# EAGLE design DuAnSacXeDien_V1.0 (EAGLE 9.6.1)
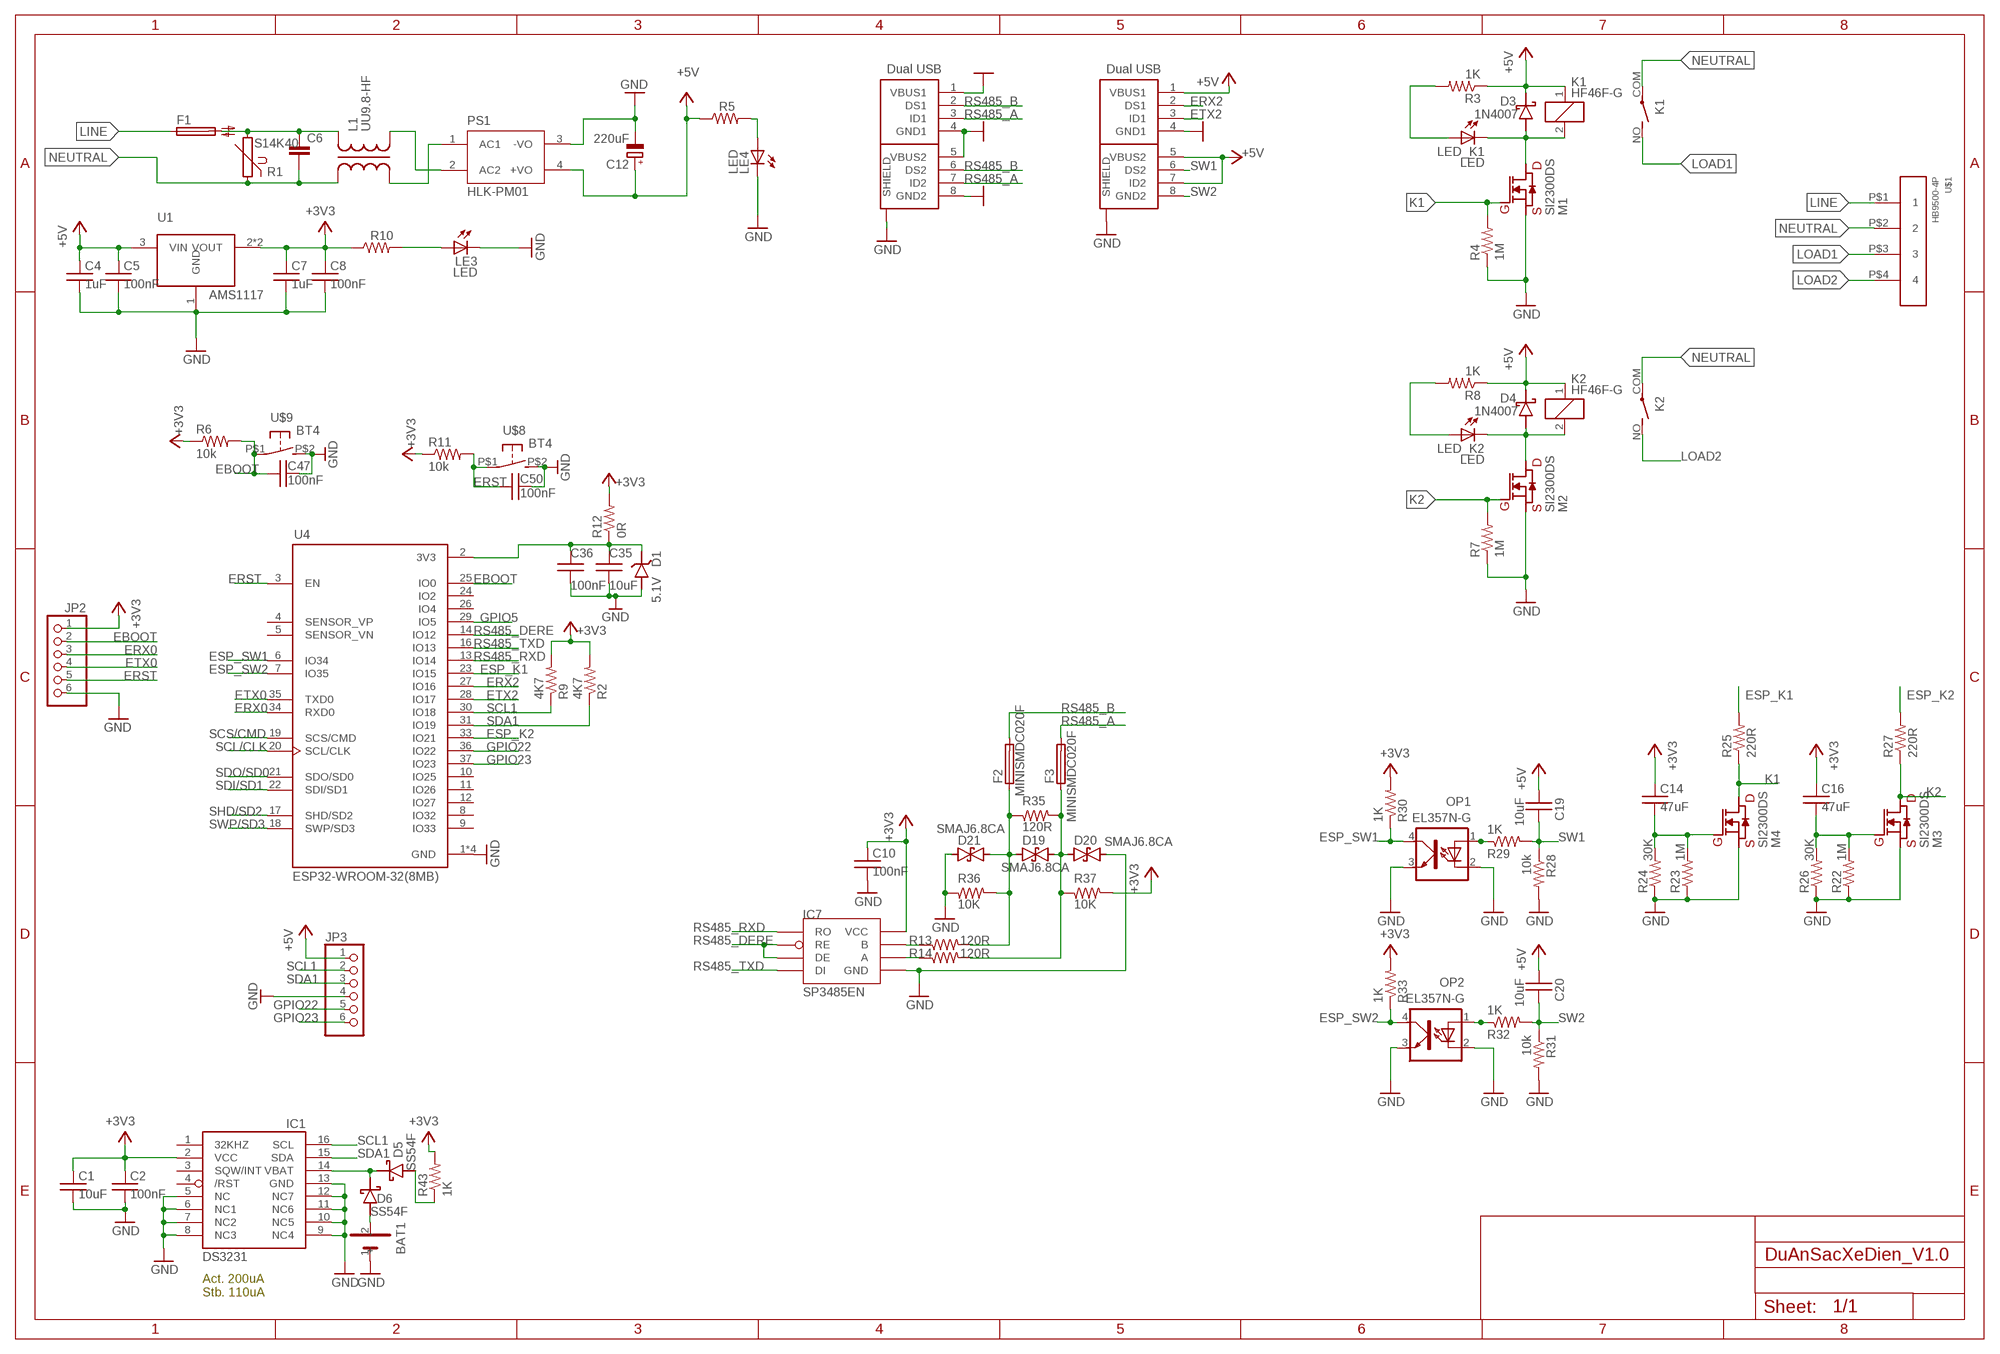
[diagram p0: schematic, sheet 1]

## Parts
BAT1  CR1220  CR1220CR1220-SMD  [CR1220]
C1  10uF  C0603  [0603]
C2  100nF  C0603  [0603]
C4  1uF  C0603  [0603]
C5  100nF  C0603  [0603]
C6  C-EU150-064X183  [C150-064X183]
C7  1uF  C0603  [0603]
C8  100nF  C0603  [0603]
C10  100nF  C0603  [0603]
C12  220uF  CPOL-EU153CLV-0605  [153CLV-0605]
C14  47uF  C0805  [0805]
C16  47uF  C0805  [0805]
C19  10uF  C0603  [0603]
C20  10uF  C0603  [0603]
C35  10uF  C0603  [0603]
C36  100nF  C0603  [0603]
C47  100nF  C0603  [0603]
C50  100nF  C0603  [0603]
D1  5.1V  BZT52CXXX  [SOD123]
D3  1N4007  SS54F  [SMAF]
D4  1N4007  SS54F  [SMAF]
D5  SS54F  [SMAF]
D6  SS54F  [SMAF]
D19  SMAJ6.8CA  SMAJ-CA  [DO-214AC-BI]
D20  SMAJ6.8CA  SMAJ-CA  [DO-214AC-BI]
D21  SMAJ6.8CA  SMAJ-CA  [DO-214AC-BI]
F1  TE5  [TE5]
F2  MINISMDC020F  MINISMDC  [C1812]
F3  MINISMDC020F  MINISMDC  [C1812]
IC1  DS3231/SO  [SO16W]
IC7  SP3485EN  [SOIC-8]
JP2  PINHD-1X6  [1X06]
JP3  PINHD-1X6/LONG  [1X06]
K1  HF46F-G  LD14H  [LD]
K2  HF46F-G  LD14H  [LD]
L1  UU9.8-HF  [UU9.8-HF]
LE3  LED  [LED3MM]
LE4  LED  [LED3MM]
LED_K1  LED  [LED3MM]
LED_K2  LED  [LED3MM]
M1  SI2300DS  MOSFETN  [SOT23(1)]
M2  SI2300DS  MOSFETN  [SOT23(1)]
M3  SI2300DS  MOSFETN  [SOT23(1)]
M4  SI2300DS  MOSFETN  [SOT23(1)]
OP1  EL357N-G  [SOP4]
OP2  EL357N-G  [SOP4]
PS1  HLK-PM01  [HLK-PMXX]
R1  S14K40  [S14K40]
R2  4K7  R0603  [0603]
R3  1K  R0603  [0603]
R4  1M  R0603  [0603]
R5  1K  R0603  [0603]
R6  10k  R0603  [0603]
R7  1M  R0603  [0603]
R8  1K  R0603  [0603]
R9  4K7  R0603  [0603]
R10  1K  R0603  [0603]
R11  10k  R0603  [0603]
R12  0R  R0603  [0603]
R13  120R  R0603  [0603]
R14  120R  R0603  [0603]
R22  1M  R0603  [0603]
R23  1M  R0603  [0603]
R24  30K  R0603  [0603]
R25  220R  R0603  [0603]
R26  30K  R0603  [0603]
R27  220R  R0603  [0603]
R28  10k  R0603  [0603]
R29  1K  R0603  [0603]
R30  1K  R0603  [0603]
R31  10k  R0603  [0603]
R32  1K  R0603  [0603]
R33  1K  R0603  [0603]
R35  120R  R0603  [0603]
R36  10K  R0603  [0603]
R37  10K  R0603  [0603]
R43  1K  R0603  [0603]
U1  LD1117  AMS1117  [SOT223-3.3]
U4  ESP32-WROOM-32(8MB)  [MODULE_ESP32-WROOM-32(8MB)]
U$1  HB9500-4P  [HB9500-4P]
U$2  DUAL_USB  [DUAL_USB]
U$7  DUAL_USB  [DUAL_USB]
U$8  BT4  [BT4]
U$9  BT4  [BT4]

## Nets
+3V3: C1.1 C2.1 C7.1 C8.1 C10.1 C14.1 C16.1 IC1.2(VCC) IC7.8(VCC) JP2.1 R2.2 R6.1 R9.2 R10.1 R11.1 R12.2 R30.2 R33.2 R37.2 R43.2 U1.2(VOUT) U1.4(VOUT)
+5V: C4.1 C5.1 C12.+ C19.1 C20.1 D3.C D4.C JP3.1 K1.1 K2.1 PS1.4(+VO) R3.1 R5.1 R8.1 U1.3(VIN) U$2.1(VBUS1) U$2.5(VBUS2) U$2.7(ID2)
EBOOT: C47.1 JP2.2 R6.2 U4.25(IO0) U$9.P$1
ERST: C50.1 JP2.5 R11.2 U4.3(EN) U$8.P$1
ERX0: JP2.3 U4.34(RXD0)
ERX2: U4.27(IO16) U$2.2(DS1)
ESP_K1: R25.2 U4.23(IO15)
ESP_K2: R27.2 U4.33(IO21)
ESP_SW1: OP1.4(COL) R30.1 U4.6(IO34)
ESP_SW2: OP2.4(COL) R33.1 U4.7(IO35)
ETX0: JP2.4 U4.35(TXD0)
ETX2: U4.28(IO17) U$2.3(ID1)
GND: BAT1.1(-) C1.2 C2.2 C4.2 C5.2 C7.2 C8.2 C10.2 C12.- C35.2 C36.2 C47.2 C50.2 D1.A D20.2 D21.1 IC1.5(NC) IC1.6(NC1) IC1.7(NC2) IC1.8(NC3) IC1.9(NC4) IC1.10(NC5) IC1.11(NC6) IC1.12(NC7) IC1.13(GND) IC7.5(GND) JP2.6 JP3.4 LE3.K(C) LE4.K(C) M1.2(S) M2.2(S) M3.2(S) M4.2(S) OP1.2(C) OP1.3(EMIT) OP2.2(C) OP2.3(EMIT) PS1.3(-VO) R4.1 R7.1 R22.1 R23.1 R24.1 R26.1 R28.2 R31.2 R36.1 U1.1(GND) U4.1(GND) U4.15(GND) U4.38(GND) U4.39(GND) U$2.4(GND1) U$2.TAB1(SHIELD) U$2.TAB2(SHIELD) U$2.TAB3(SHIELD) U$2.TAB4(SHIELD) U$7.1(VBUS1) U$7.4(GND1) U$7.5(VBUS2) U$7.8(GND2) U$7.TAB1(SHIELD) U$7.TAB2(SHIELD) U$7.TAB3(SHIELD) U$7.TAB4(SHIELD) U$8.P$2 U$9.P$2
GPIO5: U4.29(IO5)
GPIO22: JP3.5 U4.36(IO22)
GPIO23: JP3.6 U4.37(IO23)
K1: M1.1(G) M4.3(D) R4.2 R25.1
K2: M2.1(G) M3.3(D) R7.2 R27.1
LINE: F1.1 U$1.P$1
LOAD1: K1.NO(2:S) U$1.P$3
LOAD2: K2.NO(2:S) U$1.P$4
N$1: D3.A K1.2 LED_K1.K(C) M1.3(D)
N$2: D19.1 D21.2 F2.1 R13.2 R35.1 R36.2
N$3: D4.A K2.2 LED_K2.K(C) M2.3(D)
N$4: LED_K2.A R8.2
N$5: OP1.1(A) R29.1
N$6: LED_K1.A R3.2
N$7: D19.2 D20.1 F3.1 R14.2 R35.2 R37.1
N$8: OP2.1(A) R32.1
N$9: C16.2 M3.1(G) R22.2 R26.2
N$10: C6.1 F1.2 L1.4 R1.2
N$11: IC7.6(A) R14.1
N$12: IC7.7(B) R13.1
N$13: LE4.A R5.2
N$16: C35.1 C36.1 D1.C R12.1 U4.2(3V3)
N$17: BAT1.2(+) D6.A
N$18: L1.3 PS1.2(AC2)
N$19: L1.2 PS1.1(AC1)
N$25: D5.A R43.1
N$26: C14.2 M4.1(G) R23.2 R24.2
N$36: LE3.A R10.2
NEUTRAL: C6.2 K1.COM(2:P) K2.COM(2:P) L1.1 R1.1 U$1.P$2
RS485_A: F3.2 U$7.3(ID1) U$7.7(ID2)
RS485_B: F2.2 U$7.2(DS1) U$7.6(DS2)
RS485_DERE: IC7.2(RE) IC7.3(DE) U4.14(IO12)
RS485_RXD: IC7.1(RO) U4.13(IO14)
RS485_TXD: IC7.4(DI) U4.16(IO13)
SCL1: IC1.16(SCL) JP3.2 R9.1 U4.30(IO18)
SCL/CLK: U4.20(SCL/CLK)
SCS/CMD: U4.19(SCS/CMD)
SDA1: IC1.15(SDA) JP3.3 R2.1 U4.31(IO19)
SDI/SD1: U4.22(SDI/SD1)
SDO/SD0: U4.21(SDO/SD0)
SHD/SD2: U4.17(SHD/SD2)
SW1: C19.2 R28.1 R29.2 U$2.6(DS2)
SW2: C20.2 R31.1 R32.2 U$2.8(GND2)
SWP/SD3: U4.18(SWP/SD3)
VBAT: D5.C D6.C IC1.14(VBAT)
Unconnected: IC1.1(32KHZ) IC1.3(SQW/INT) IC1.4(/RST) U4.4(SENSOR_VP) U4.5(SENSOR_VN) U4.8(IO32) U4.9(IO33) U4.10(IO25) U4.11(IO26) U4.12(IO27) U4.24(IO2) U4.26(IO4)

## Notes on the sheet
- Act. 200uA
  Stb. 110uA

## Library data of the parts
BAT1 = An:CR1220
C1 C2 C4 C5 C7 C8 C10 C19 C20 = Dkoi-updated:C0603
C6 = rcl:C-EU: CAPACITOR, European symbol; SPICEPREFIX: C
C12 = rcl:CPOL-EU: POLARIZED CAPACITOR, European symbol; SPICEPREFIX: C
C14 C16 = Bao:C0805
C35 C36 C47 C50 = Dkoi:C0603
D1 = Dkoi:BZT52CXXX
D3-D6 = Uy_SMD:SS54F
D19-D21 = TADT:SMAJ-CA: Bi-directional TVS diode Datasheet <https://www.littelfuse.com/~/media/electronics/datasheets/tvs_diodes/littelfuse_tvs_diode_smaj_datasheet.pdf.pdf>
F1 = fuse:TE5: FUSE Wickmann; OC_FARNELL: unknown; OC_NEWARK: unknown
F2 F3 = TADT:MINISMDC: Polyswitch Resetable Fuse Datasheet <https://www.littelfuse.com/~/media/electronics/datasheets/resettable_ptcs/littelfuse_ptc_minismd_catalog_datasheet.pdf.pdf> Mounting Type: Surface Mount Package Case: 1812 (4532 Metric), Concave Size Dimension: 0.179" L x 0.128" W (4.55mm x 3.24mm) Thickness (Max): 0.035" (0.89mm)
IC1 = TADT:DS3231
IC7 = Uy_SMD:SP3485EN
JP2 = pinhead:PINHD-1X6: PIN HEADER
JP3 = pinhead_v2:PINHD-1X6: PIN HEADER
K1 K2 = relay:LD?*: Slim Power Relay NAiS Source: http://www.mew-europe.com/.. en_ds_61112_0000.pdf; OC_FARNELL: unknown; OC_NEWARK: unknown
L1 = Dkoi-updated:UU9.8-HF
LE3 LE4 LED_K1 LED_K2 = Uy_SMD:LED
M1-M4 = Dkoi:MOSFETN
OP1 OP2 = Dkoi-updated:EL357N-G
PS1 = HLK:HLK-PM: AC DC 220V to 3V-5V-12V-24V 3W Isolated Switching Step-Down Power Supply Module Converter Variant Output Datasheet thegioiic.com HLK-PM03 3.3V http://www.hlktech.net/product_detail.php?ProId=59 https://www.thegioiic.com/products/hlk-pm03-chuyen-doi-ac-dc-220-3-3v-3w-hi-link HLK-PM01 5.0V http://www.hlktech.net/product_detail.php?ProId=54 https://www.thegioiic.com/products/hlk-5m05-chuyen-doi-ac-dc-220-5v-5w-hi-link HLK-PM12 12.0V http://www.hlktech.net/product_detail.php?ProId=56 https://www.thegioiic.com/products/hlk-pm12-chuyen-doi-ac-dc-220-12v-3w-hi-link HLK-PM24 24.0V http://www.hlktech.net/product_detail.php?ProId=81 https://www.thegioiic.com/products/hlk-pm24-chuyen-doi-ac-dc-220-24v-3w-hi-link; DATASHEET: http://www.hlktech.net/product_detail.php?ProId=54; THEGIOIIC: https://www.thegioiic.com/products/hlk-5m05-chuyen-doi-ac-dc-220-5v-5w-hi-link
R1 = varistor:S14K40: VARISTOR
R2-R5 R7-R10 R13 R14 R22-R33 R35-R37 R43 = Dkoi-updated:R0603
R6 R11 R12 = Dkoi:R0603
U1 = An:AMS1117
U4 = Uy_SMD:ESP32-WROOM-32(8MB): WIFI MODULE 64 MBITS SPI FLASH Check prices <https://pricing.snapeda.com/parts/ESP32-WROOM-32%20%288MB%29/Espressif%20Systems/view-part?ref=eda>; AVAILABILITY: Not in stock; DESCRIPTION: Bluetooth, WiFi 802.11b/g/n, Bluetooth v4.2 +EDR, Class 1, 2 and 3 Transceiver Module 2.4GHz ~ 2.5GHz - Surface Mount; MF: Espressif Systems; MP: ESP32-WROOM-32 (8MB); PACKAGE: Module Espressif Systems; PRICE: None
U$1 = Uy_DIP:HB9500-4P
U$2 U$7 = Bao:DUAL_USB
U$8 U$9 = Uy_SMD:BT4

## Board
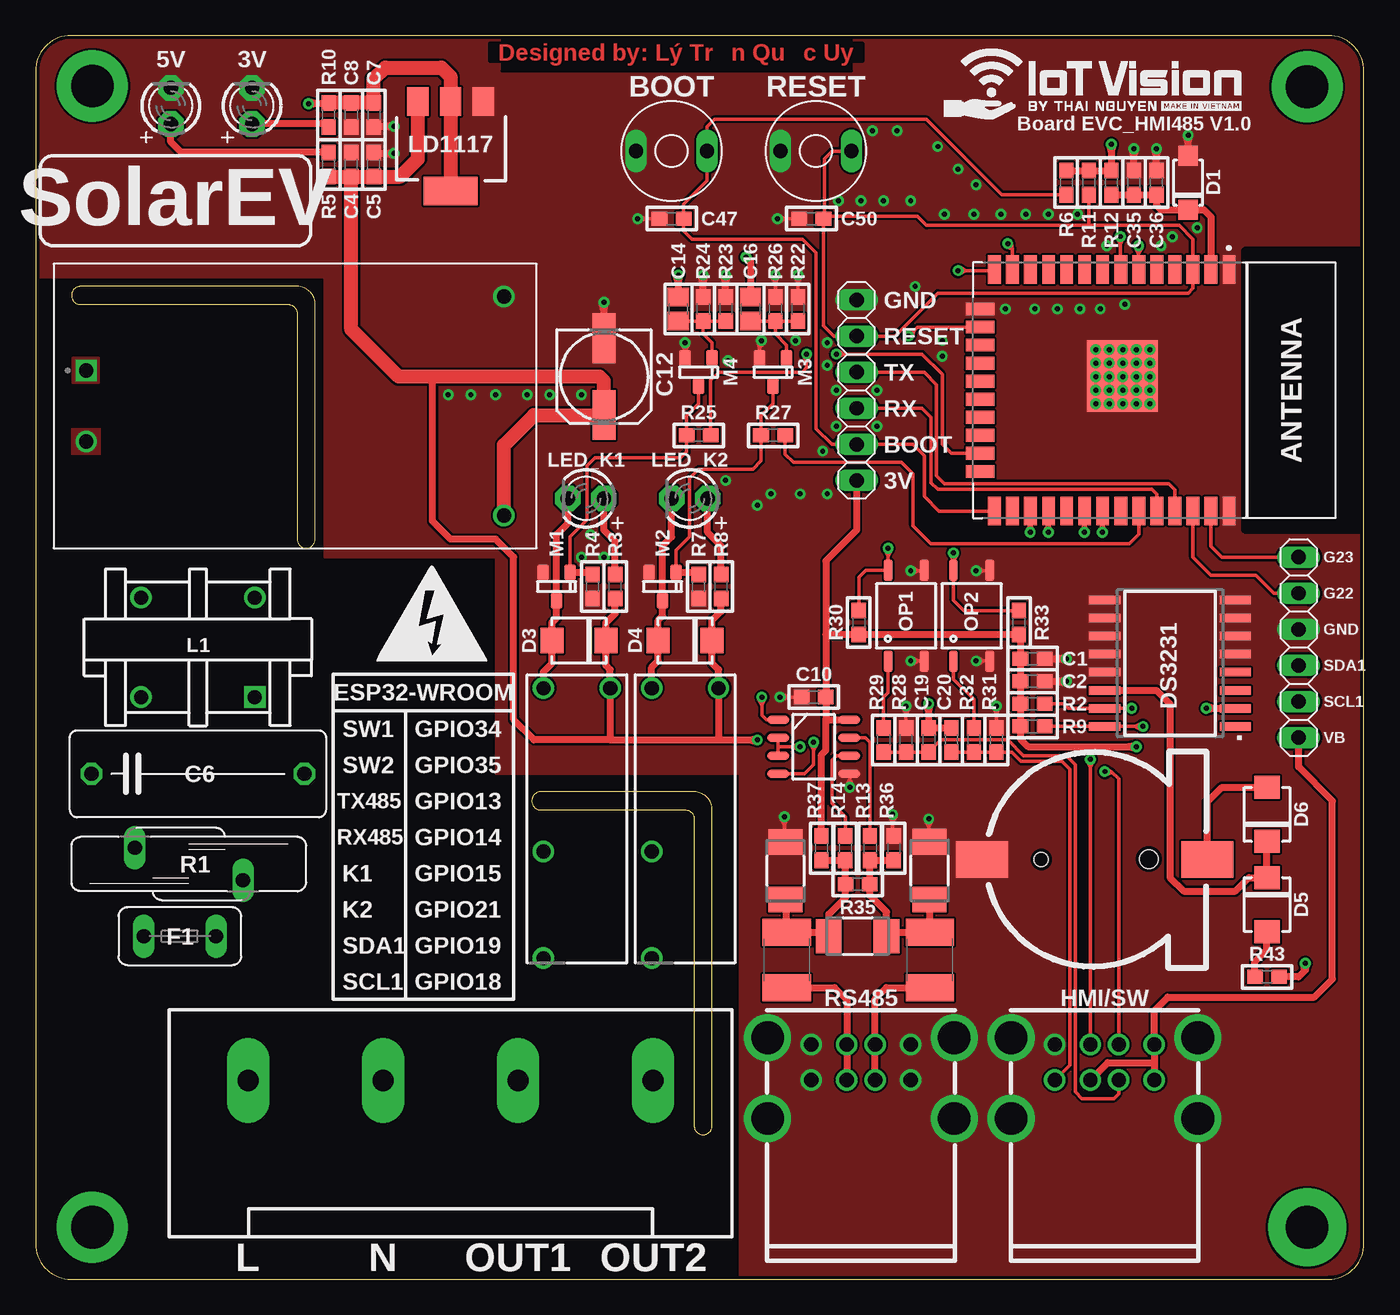
[diagram p1: board, top side]
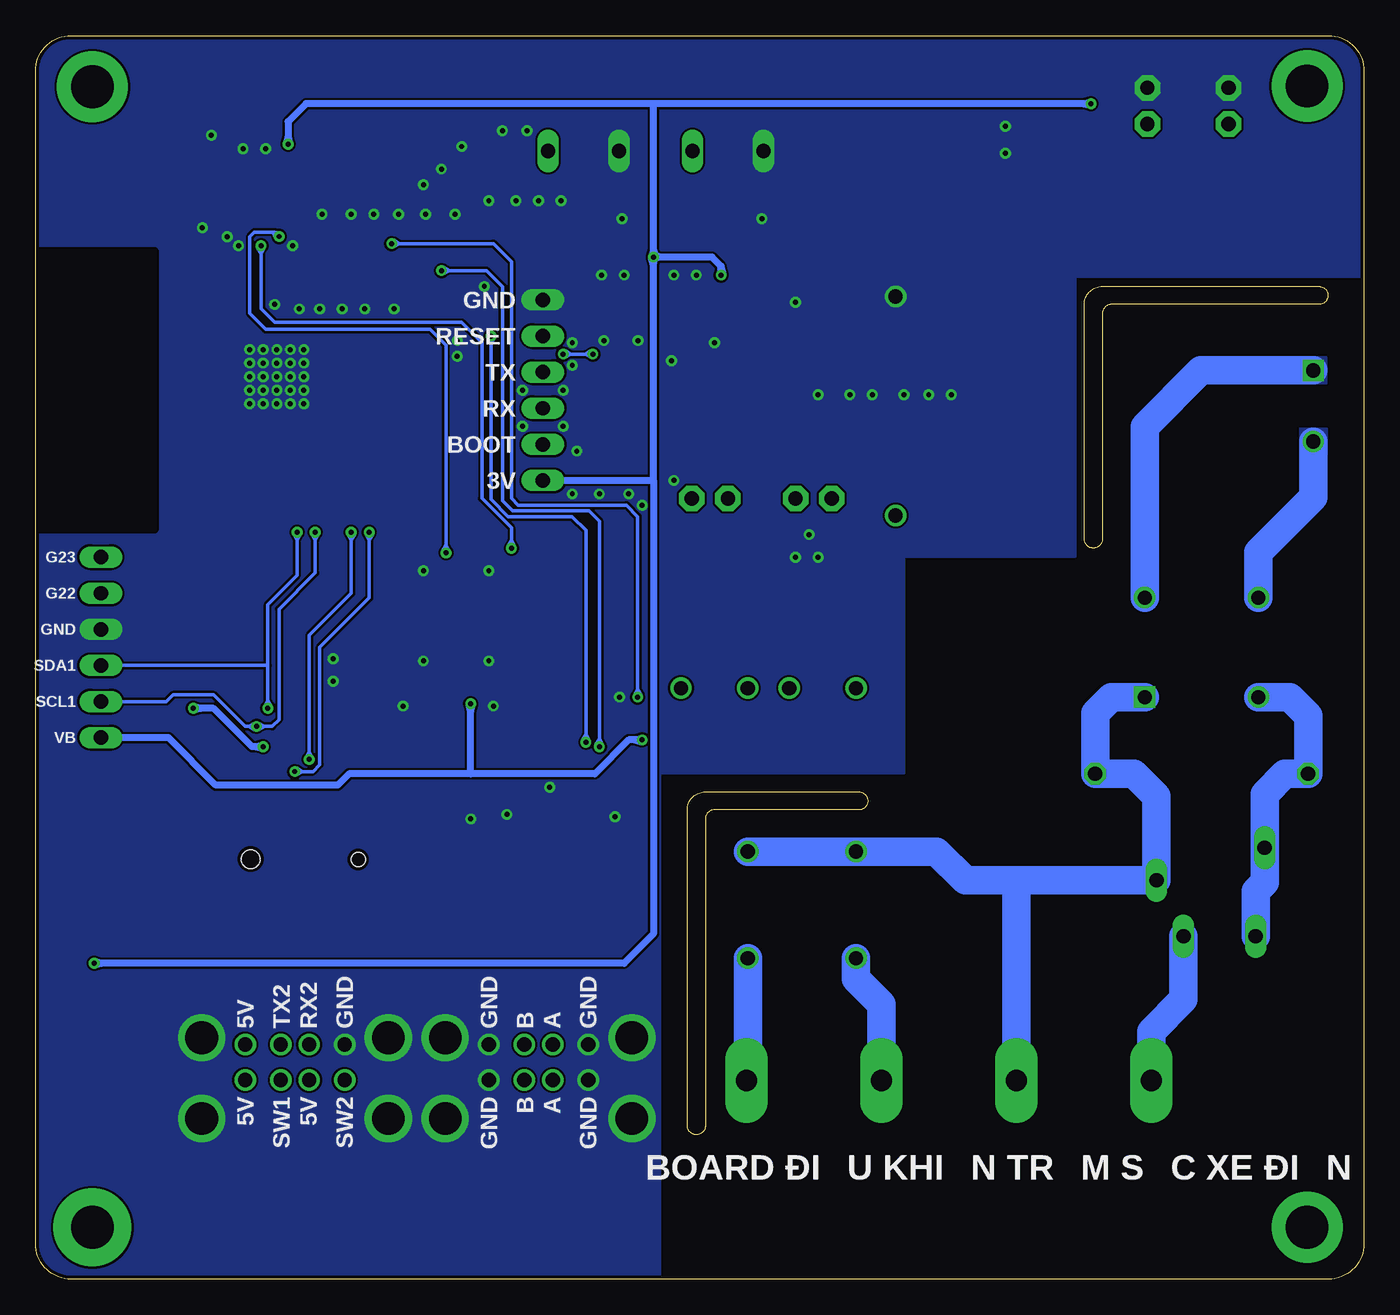
[diagram p2: board, bottom side, seen from below]

Size 93.5 x 87.5 mm. Coordinates in mm from the lower left corner, seen from the top.
Outline: 35.56,34.29 arc90 34.92,33.66 arc90 35.56,33.02 45.72,33.02 arc-90 46.35,32.38 46.35,10.79 arc90 46.99,10.16 arc90 47.62,10.79 47.62,33.02 arc90 46.35,34.29 35.56,34.29
Outline: 3.17,69.85 arc90 2.54,69.22 arc90 3.17,68.58 17.78,68.58 arc-90 18.41,67.94 18.41,52.07 arc90 19.05,51.44 arc90 19.68,52.07 19.68,68.58 arc90 18.41,69.85 3.17,69.85
Outline: 0,2.5 arc90 2.5,0 91,0 arc90 93.5,2.5 93.5,85 arc90 91,87.5 2.5,87.5 arc90 0,85 0,2.5
Copper layers (1*16): Top 0.035mm / dielectric 1.6mm / Bottom 0.035mm
Design rules "Dkoi": minimum track width 0.15mm, minimum drill 0.3mm, track to track 0.15mm, track to pad 0.15mm, pad to pad 0.15mm, via to via 0.15mm, smd to smd 0mil, copper to edge 0.25mm, drill to drill 0.15mm, minimum pad ring 10mil, minimum via ring 8mil, stop-mask expansion 4mil, vias tented up to drill 0.5mm, thermal gap 10mil

### Footprints (pad centres in the part's own frame; a part is rotated, then mirrored left to right if it is on the bottom)
CR1220 = smd 3.658 x 2.54: 1 -7.671,0; 2 8.179,0 | hole 1: -3.505,0 | hole 1.3: 4.064,0.025
0603 = smd 1.1 x 1: 1 -0.85,0; 2 0.85,0
C150-064X183 = drill 1.016 octagon: 1 -7.493,0; 2 7.493,0
153CLV-0605 = smd 3.5 x 1.6: + 2.7,0; - -2.7,0
0805 = smd 1.3 x 1.5: 1 -0.85,0; 2 0.85,0
SOD123 = smd 1.4 x 1.4: A 0,-1.9; C 0,1.9
SMAF = smd 1.6 x 1.8: A 0,0; C 3.8,0
DO-214AC-BI = smd 1.8 x 2.4: 1 -2.025,0; 2 2.025,0
TE5 = drill 1.016 long: 1 -2.54,0; 2 2.54,0
C1812 = smd 1.9 x 3.4: 1 -1.95,0; 2 1.95,0
SO16W = smd 0.6 x 2.2: 1 -4.445,-4.6; 2 -3.175,-4.6; 3 -1.905,-4.6; 4 -0.635,-4.6; 5 0.635,-4.6; 6 1.905,-4.6; 7 3.175,-4.6; 8 4.445,-4.6; 9 4.445,4.6; 10 3.175,4.6; 11 1.905,4.6; 12 0.635,4.6; 13 -0.635,4.6; 14 -1.905,4.6; 15 -3.175,4.6; 16 -4.445,4.6
SOIC-8 = smd 0.6 x 1.55: 1 -1.905,-2.5; 2 -0.635,-2.5; 3 0.635,-2.5; 4 1.905,-2.5; 5 1.905,2.5; 6 0.635,2.5; 7 -0.635,2.5; 8 -1.905,2.5
1X06 = drill 1.016 long: 1 -6.35,0; 2 -3.81,0; 3 -1.27,0; 4 1.27,0; 5 3.81,0; 6 6.35,0
LD = drill 1: 1 -9.2,2.35; 2 -9.2,-2.35; COM 2.3,-2.35; NO 9.8,-2.35
UU9.8-HF = drill 1 square: 1 -4,3.5 | drill 1: 2 -4,-3.5; 3 4,-3.5; 4 4,3.5
LED3MM = drill 1 pad 1.8 octagon: A -1.27,0; K 1.27,0
SOT23(1) = smd 0.8 x 1.1: 1 -0.95,-1; 2 0.95,-1; 3 0,1
SOP4 = smd 1.5 x 0.6: 1 -3.2,1.27; 2 -3.2,-1.27; 3 3.2,-1.27; 4 3.2,1.27
HLK-PMXX = drill 1 square: 1 -15.48,2.34 | drill 1: 2 -15.48,-2.66; 3 13.92,7.54; 4 13.92,-7.86
S14K40 = drill 1.016 long: 1 -1.143,-3.81; 2 1.143,3.81
SOT223-3.3 = smd 1.5 x 2: 1 -2.3,-2.54; 2 0,-2.54; 3 2.3,-2.54 | smd 3.8 x 2: 4 0,3.76
MODULE_ESP32-WROOM-32(8MB) = smd 2 x 0.9: 1 -8.5,5.26; 2 -8.5,3.99; 3 -8.5,2.72; 4 -8.5,1.45; 5 -8.5,0.18; 6 -8.5,-1.09; 7 -8.5,-2.36; 8 -8.5,-3.63; 9 -8.5,-4.9; 10 -8.5,-6.17; 11 -8.5,-7.44; 12 -8.5,-8.71; 13 -8.5,-9.98; 14 -8.5,-11.25; 25 8.5,-11.25; 26 8.5,-9.98; 27 8.5,-8.71; 28 8.5,-7.44; 29 8.5,-6.17; 30 8.5,-4.9; 31 8.5,-3.63; 32 8.5,-2.36; 33 8.5,-1.09; 34 8.5,0.18; 35 8.5,1.45; 36 8.5,2.72; 37 8.5,3.99; 38 8.5,5.26 | smd 0.9 x 2: 15 -5.715,-12.25; 16 -4.445,-12.25; 17 -3.175,-12.25; 18 -1.905,-12.25; 19 -0.635,-12.25; 20 0.635,-12.25; 21 1.905,-12.25; 22 3.175,-12.25; 23 4.445,-12.25; 24 5.715,-12.25 | smd 5 x 5: 39 -1,-2.24
HB9500-4P = drill 1.5 pad 3 long: P$1 -14.25,0; P$2 -4.75,0; P$3 4.75,0; P$4 14.25,0
DUAL_USB = drill 1 pad 1.5: 1 0,0; 2 2.5,0; 3 4.5,0; 4 7,0; 5 0,2.5; 6 2.5,2.5; 7 4.5,2.5; 8 7,2.5 | drill 2.3 pad 2.8: TAB1 -3.07,-0.48; TAB2 10.07,-0.48; TAB3 -3.07,5.2; TAB4 10.07,5.2
BT4 = drill 1 long: P$1 -2.5,0; P$2 2.5,0

### Placement (x,y rotation side)
BAT1  74.3,29.53 0 top
C1  70.17,43.66 0 top
C2  70.17,42.07 0 top
C4  22.23,78.42 90 top
C5  23.81,78.42 90 top
C6  11.43,35.56 0 top
C7  23.81,81.92 270 top
C8  22.23,81.92 270 top
C10  54.77,40.96 180 top
C12  40.01,63.5 270 top
C14  45.24,68.26 270 top
C16  50.32,68.26 270 top
C19  62.87,37.94 270 top
C20  64.45,37.94 270 top
C35  77.31,77.15 90 top
C36  78.9,77.15 90 top
C47  44.77,74.61 180 top
C50  54.61,74.61 180 top
D1  81.12,77.15 180 top
D3  36.35,44.93 0 top
D4  43.81,44.93 0 top
D5  86.68,24.45 90 top
D6  86.68,34.61 270 top
D19  57.86,24.13 180 top
D20  52.78,28.73 90 top
D21  62.92,28.75 270 top
F1  10.16,24.13 180 top
F2  62.94,22.46 270 top
F3  52.86,22.46 270 top
IC1  79.85,43.34 90 top
IC7  54.77,37.47 270 top
JP2  57.78,62.55 90 top
JP3  88.9,44.45 90 top
K1  38.1,32.38 270 top
K2  45.72,32.38 270 top
L1  11.43,44.45 180 top
LE3  15.24,82.55 90 top
LE4  9.53,82.55 90 top
LED_K1  38.73,54.93 180 top
LED_K2  46.04,54.93 180 top
M1  36.67,48.74 180 top
M2  44.13,48.74 180 top
M3  51.91,63.82 180 top
M4  46.67,63.82 180 top
OP1  61.28,46.67 90 top
OP2  65.88,46.67 90 top
PS1  19.05,61.59 0 top
R1  10.79,29.21 90 top
R2  70.17,40.48 180 top
R3  40.8,48.74 90 top
R4  39.21,48.74 90 top
R5  20.64,78.42 90 top
R6  72.55,77.15 270 top
R7  46.67,48.74 90 top
R8  48.26,48.74 90 top
R9  70.17,38.89 180 top
R10  20.64,81.92 270 top
R11  74.14,77.15 270 top
R12  75.72,77.15 90 top
R13  58.74,30.32 270 top
R14  56.99,30.32 270 top
R22  53.66,68.26 270 top
R23  48.58,68.26 270 top
R24  46.99,68.26 270 top
R25  46.67,59.37 0 top
R26  52.07,68.26 270 top
R27  51.91,59.37 0 top
R28  61.28,37.94 90 top
R29  59.69,37.94 270 top
R30  57.94,46.2 270 top
R31  67.63,37.94 90 top
R32  66.04,37.94 270 top
R33  69.22,46.2 270 top
R35  57.86,27.78 180 top
R36  60.4,30.32 270 top
R37  55.32,30.32 90 top
R43  86.68,21.27 0 top
U1  29.21,80.33 180 top
U4  78.74,62.55 270 top
U$1  29.21,13.97 0 top
U$2  78.74,16.51 180 top
U$7  61.59,16.51 180 top
U$8  54.93,79.38 180 top
U$9  44.77,79.38 180 top

### Tracks (layer width: path | path; a pad name or v marks a point on that pad's centre or on a via)
+3V3  (via drill 0.35)
  Top 0.5: JP2.1 57.78,52.7 55.62,50.54 55.62,45.35 | 76.94,37.47 69.85,37.47 69.32,38 R9.2 R2.2 C2.1 C1.1 69.32,45.24 R33.2 R30.2 55.62,45.35 | 76.94,37.47 v77.47,37.47 | v82.39,40.16 82.92,40.16 | 82.92,40.16 IC1.2 | R10.1 20.58,82.71 19.73,82.71 | 19.73,82.71 v19.21,82.71 | R6.1 R11.1 R12.2 75.72,79.33 | v75.72,79.85 75.72,79.33 | C14.1 45.24,70.12 | 45.24,70.12 v45.24,70.64 | 55.62,45.35 C10.1 55.62,39.37 | 55.62,39.37 IC7.8 | R37.2 55.32,36.91 55.62,37.2 55.62,39.37 | v89.38,22.23 89.38,21.75 89.33,21.7 | 89.33,21.7 88.9,21.27 R43.2 | v50.01,71.91 50.32,71.6 50.32,71.5 | 50.32,71.5 C16.1 | 76.94,37.47 77.44,37.34 v77.47,37.47 | 76.94,37.47 77.44,37.59 v77.47,37.47 | 82.92,40.16 82.42,40.29 v82.39,40.16 | 82.92,40.16 82.42,40.04 v82.39,40.16 | 19.73,82.71 19.24,82.83 v19.21,82.71 | 19.73,82.71 19.24,82.58 v19.21,82.71 | 75.72,79.33 75.85,79.82 v75.72,79.85 | 75.72,79.33 75.6,79.82 v75.72,79.85 | 45.24,70.12 45.37,70.61 v45.24,70.64 | 45.24,70.12 45.12,70.61 v45.24,70.64 | 89.33,21.7 89.5,22.18 v89.38,22.23 | 89.33,21.7 89.25,22.2 v89.38,22.23 | 50.32,71.5 50.12,71.96 v50.01,71.91 | 50.32,71.5 49.93,71.81 v50.01,71.91
  Top 1: U1.4 U1.2 29.21,84.61 28.57,85.25 24.61,85.25 23.81,84.45 C7.1 C8.1 R10.1
  Bottom 0.5: v77.47,37.47 78,37.47 | 78,37.47 78.26,37.47 80.96,40.16 81.87,40.16 | 81.87,40.16 v82.39,40.16 | v19.21,82.71 19.73,82.71 | 19.73,82.71 50.01,82.71 | 75.72,80.38 75.72,81.44 74.45,82.71 50.01,82.71 | 75.72,80.38 v75.72,79.85 | v45.24,70.64 45.24,71.17 | 45.24,71.17 45.24,71.28 45.88,71.91 49.48,71.91 | JP2.1 50.01,56.2 | 50.01,56.2 50.01,24.29 52.07,22.23 88.85,22.23 | 88.85,22.23 v89.38,22.23 | 50.01,56.2 50.01,71.39 | 50.01,71.39 v50.01,71.91 | v50.01,71.91 50.01,72.44 | 50.01,72.44 50.01,82.71 | 49.48,71.91 v50.01,71.91 | 78,37.47 77.5,37.59 v77.47,37.47 | 78,37.47 77.5,37.34 v77.47,37.47 | 81.87,40.16 82.36,40.04 v82.39,40.16 | 81.87,40.16 82.36,40.29 v82.39,40.16 | 19.73,82.71 19.24,82.83 v19.21,82.71 | 19.73,82.71 19.24,82.58 v19.21,82.71 | 75.72,80.38 75.6,79.88 v75.72,79.85 | 75.72,80.38 75.85,79.88 v75.72,79.85 | 45.24,71.17 45.12,70.67 v45.24,70.64 | 45.24,71.17 45.37,70.67 v45.24,70.64 | 88.85,22.23 89.34,22.1 v89.38,22.23 | 88.85,22.23 89.34,22.35 v89.38,22.23 | 50.01,71.39 50.13,71.88 v50.01,71.91 | 50.01,71.39 49.88,71.88 v50.01,71.91 | 50.01,72.44 49.88,71.94 v50.01,71.91 | 50.01,72.44 50.13,71.94 v50.01,71.91 | 49.48,71.91 49.98,71.79 v50.01,71.91 | 49.48,71.91 49.98,72.04 v50.01,71.91
+5V  (via drill 0.35)
  Top 0.5: R8.1 48.26,46.99 47.62,46.34 D4.C 47.62,43.35 48.07,42.89 K2.1 48.07,37.97 48.1,37.94 | R3.1 40.8,46.83 40.15,46.19 D3.C 40.15,43.19 40.45,42.89 K1.1 40.45,37.94 | 40.45,37.94 48.1,37.94 | 40.45,37.94 35.08,37.94 33.66,39.37 33.66,50.8 32.38,52.07 29.21,52.07 27.94,53.34 27.94,63.5 | C20.1 C19.1 62.87,39.96 | 78.74,15.24 U$2.1 78.74,18.89 79.69,19.84 90.01,19.84 91.28,21.11 91.28,33.66 88.9,36.04 JP3.1 | 78.74,15.24 U$2.5 | U$2.7 75.47,15.24 78.74,15.24 | 62.87,39.96 v62.87,40.48 | 48.1,37.94 50.27,37.94 | 50.27,37.94 v50.8,37.94 | 62.87,39.96 62.99,40.45 v62.87,40.48 | 62.87,39.96 62.74,40.45 v62.87,40.48 | 50.27,37.94 50.77,37.82 v50.8,37.94 | 50.27,37.94 50.77,38.07 v50.8,37.94
  Top 1: PS1.4 32.97,58.69 35.08,60.8 C12.+ 40.01,63.18 39.69,63.5 27.94,63.5 25.56,63.5 22.23,66.83 C4.1 | C4.1 C5.1 25.66,77.57 26.91,78.82 U1.3 | R5.1 C4.1
  Bottom 0.5: v50.8,37.94 51.33,37.94 | 51.33,37.94 51.75,37.94 54.13,35.56 62.87,35.56 | 62.87,35.56 62.87,39.96 | 62.87,39.96 v62.87,40.48 | 62.87,35.56 71.44,35.56 72.23,34.77 80.8,34.77 84.14,38.1 JP3.1 | 62.87,39.96 62.99,40.45 v62.87,40.48 | 62.87,39.96 62.74,40.45 v62.87,40.48 | 51.33,37.94 50.83,38.07 v50.8,37.94 | 51.33,37.94 50.83,37.82 v50.8,37.94
EBOOT
  Top 0.25: U4.25 63.59,54.05 62.55,55.09 62.55,57.94 61.75,58.74 JP2.2 56.04,58.74 54.93,59.85 54.93,72.23 53.98,73.18 46.2,73.18 45.62,73.76 C47.1 45.62,75.62 47.27,77.27 U$9.P$1 47.27,81.08 47.78,81.6 62.71,81.6 68,76.3 R6.2
ERST
  Top 0.25: 74.14,74.14 R11.2 | 74.14,74.14 80.49,74.14 81.46,73.16 U4.3 81.46,69.71 81.12,69.37 63.5,69.37 60.48,66.36 JP2.5 56.2,66.36 55.46,67.09 C50.1 55.51,74.66 | 74.14,74.14 62.71,74.14 62.07,74.77 55.62,74.77 55.51,74.66 | U$8.P$1 56.04,79.38 55.51,78.85 55.51,74.66
ERX0
  Top 0.25: U4.34 78.92,55.22 78.58,55.56 63.5,55.56 63.02,56.04 63.02,60.64 62.39,61.28 JP2.3
ERX2  (via drill 0.35)
  Top 0.25: U4.27 70.01,54.03 70.01,53.07 | 70.01,53.07 v70.01,52.55 | U$2.2 76.24,35.2 75.77,35.67 | v75.25,35.72 75.72,35.72 75.77,35.67 | 70.01,53.07 69.79,52.67 v70.01,52.55 | 70.01,53.07 70.23,52.67 v70.01,52.55 | 75.77,35.67 75.39,35.93 v75.25,35.72 | 75.77,35.67 75.35,35.49 v75.25,35.72
  Bottom 0.25: v70.01,52.55 70.01,52.02 | 70.01,52.02 70.01,47.94 73.5,44.45 73.5,36.2 73.98,35.72 74.72,35.72 | v75.25,35.72 74.72,35.72 | 70.01,52.02 70.23,52.42 v70.01,52.55 | 70.01,52.02 69.79,52.42 v70.01,52.55 | 74.72,35.72 75.12,35.5 v75.25,35.72 | 74.72,35.72 75.12,35.94 v75.25,35.72
ESP_K1  (via drill 0.35)
  Top 0.25: U4.23 64.46,58.1 63.82,58.74 63.82,63.65 62.39,65.09 56.88,65.09 | v54.27,65.09 54.27,64.56 | 54.27,64.56 54.27,64.12 53.98,63.82 48.1,63.82 47.52,63.24 R25.2 | 56.88,65.09 v56.36,65.09 | 56.88,65.09 56.48,65.31 v56.36,65.09 | 56.88,65.09 56.48,64.87 v56.36,65.09 | 54.27,64.56 54.5,64.97 v54.27,65.09 | 54.27,64.56 54.05,64.97 v54.27,65.09
  Bottom 0.25: v56.36,65.09 55.83,65.09 | 55.83,65.09 54.8,65.09 | 54.8,65.09 v54.27,65.09 | 55.83,65.09 56.23,64.87 v56.36,65.09 | 55.83,65.09 56.23,65.31 v56.36,65.09 | 54.8,65.09 54.4,65.31 v54.27,65.09 | 54.8,65.09 54.4,64.87 v54.27,65.09
ESP_K2
  Top 0.25: U4.33 77.65,52.41 76.99,51.75 63.02,51.75 61.75,53.02 61.75,56.67 60.96,57.47 53.34,57.47 52.76,58.05 R27.2
ESP_SW1  (via drill 0.35)
  Top 0.25: U4.6 77.63,71.07 77.63,72.18 | 77.63,72.18 v77.63,72.71 | R30.1 57.94,49.37 58.45,49.87 OP1.4 60.01,50.91 | 60.01,50.91 v60.01,51.44 | 77.63,72.18 77.85,72.58 v77.63,72.71 | 77.63,72.18 77.41,72.58 v77.63,72.71 | 60.01,50.91 60.23,51.31 v60.01,51.44 | 60.01,50.91 59.79,51.31 v60.01,51.44
  Bottom 0.25: v77.63,72.71 77.63,72.18 | 77.63,72.18 77.63,68.26 76.68,67.31 63.5,67.31 62.07,65.88 62.07,54.93 60.01,52.86 60.01,51.96 | 60.01,51.96 v60.01,51.44 | 77.63,72.18 77.85,72.58 v77.63,72.71 | 77.63,72.18 77.41,72.58 v77.63,72.71 | 60.01,51.96 59.79,51.56 v60.01,51.44 | 60.01,51.96 60.23,51.56 v60.01,51.44
ESP_SW2  (via drill 0.35)
  Top 0.25: U4.7 76.36,71.07 76.36,72.84 | 76.36,72.84 v76.36,73.36 | R33.1 65.35,47.05 64.61,47.78 OP2.4 64.61,50.57 | 64.61,50.57 v64.61,51.1 | 76.36,72.84 76.58,73.24 v76.36,73.36 | 76.36,72.84 76.14,73.24 v76.36,73.36 | 64.61,50.57 64.83,50.98 v64.61,51.1 | 64.61,50.57 64.39,50.98 v64.61,51.1
  Bottom 0.25: v76.36,73.36 76.66,73.66 76.79,73.66 | 76.79,73.66 78.11,73.66 78.42,73.34 78.42,67.94 77.31,66.83 65.72,66.83 64.61,65.72 64.61,51.62 | v64.61,51.1 64.61,51.62 | 76.79,73.66 76.33,73.61 v76.36,73.36 | 76.79,73.66 76.59,73.25 v76.36,73.36 | 64.61,51.62 64.39,51.22 v64.61,51.1 | 64.61,51.62 64.83,51.22 v64.61,51.1
ETX0
  Top 0.25: U4.35 80.19,55.54 79.77,55.96 63.98,55.96 63.42,56.52 63.42,62.94 62.55,63.82 JP2.4
ETX2  (via drill 0.35)
  Top 0.25: v74.24,36.57 74.24,36.04 | 74.24,36.04 U$2.3 | U4.28 71.28,54.03 71.28,53.07 | 71.28,53.07 v71.28,52.55 | 71.28,53.07 71.06,52.67 v71.28,52.55 | 71.28,53.07 71.5,52.67 v71.28,52.55 | 74.24,36.04 74.46,36.45 v74.24,36.57 | 74.24,36.04 74.02,36.45 v74.24,36.57
  Bottom 0.25: v71.28,52.55 71.28,52.02 | 71.28,52.02 71.28,48.26 74.24,45.3 74.24,37.09 | 74.24,37.09 v74.24,36.57 | 71.28,52.02 71.5,52.42 v71.28,52.55 | 71.28,52.02 71.06,52.42 v71.28,52.55 | 74.24,37.09 74.02,36.69 v74.24,36.57 | 74.24,37.09 74.46,36.69 v74.24,36.57
GND  (via drill 0.35)
  Top 0.25: R22.1 53.66,70.12 | 53.66,70.12 v53.66,70.64 | R26.1 52.07,70.12 | 52.07,70.12 v52.07,70.64 | C50.2 52.75,74.61 | 52.75,74.61 v52.23,74.61 | C47.2 42.91,74.61 | 42.91,74.61 v42.39,74.61 | M4.2 45.72,65.36 | 45.72,65.36 v45.72,65.88 | M3.2 50.96,65.53 | 50.96,65.53 50.96,65.9 v51.1,66.04 | C10.2 52.91,40.96 | 52.91,40.96 v52.39,40.96 | R28.2 61.28,39.8 | 61.28,39.8 v61.28,40.32 | R31.2 67.63,39.8 | 67.63,39.8 v67.63,40.32 | OP1.3 62.52,49.85 62.12,49.85 | 62.12,49.85 v61.59,49.85 | OP2.3 67.13,49.85 66.72,49.85 | 66.72,49.85 v66.2,49.85 | OP2.2 67.13,43.5 66.72,43.5 | 66.72,43.5 v66.2,43.5 | OP1.2 62.52,43.5 62.12,43.5 | 62.12,43.5 v61.59,43.5 | IC7.5 57.31,35.52 57.31,35.13 | 57.31,35.13 v57.31,34.61 | D20.2 52.7,30.84 52.7,32.02 | 52.7,32.02 v52.7,32.54 | R36.1 60.33,31.25 60.33,32.18 | 60.33,32.18 v60.33,32.7 | D21.1 62.87,30.83 62.87,31.86 | 62.87,31.86 v62.87,32.38 | 53.66,70.12 53.88,70.52 v53.66,70.64 | 53.66,70.12 53.44,70.52 v53.66,70.64 | 52.07,70.12 52.29,70.52 v52.07,70.64 | 52.07,70.12 51.85,70.52 v52.07,70.64 | 52.75,74.61 52.35,74.83 v52.23,74.61 | 52.75,74.61 52.35,74.39 v52.23,74.61 | 42.91,74.61 42.51,74.83 v42.39,74.61 | 42.91,74.61 42.51,74.39 v42.39,74.61 | 45.72,65.36 45.94,65.76 v45.72,65.88 | 45.72,65.36 45.5,65.76 v45.72,65.88 | 50.96,65.53 51.28,65.86 v51.1,66.04 | 50.96,65.53 50.86,65.98 v51.1,66.04 | 52.91,40.96 52.51,41.18 v52.39,40.96 | 52.91,40.96 52.51,40.74 v52.39,40.96 | 61.28,39.8 61.5,40.2 v61.28,40.32 | 61.28,39.8 61.06,40.2 v61.28,40.32 | 67.63,39.8 67.85,40.2 v67.63,40.32 | 67.63,39.8 67.41,40.2 v67.63,40.32 | 62.12,49.85 61.72,50.07 v61.59,49.85 | 62.12,49.85 61.72,49.63 v61.59,49.85 | 66.72,49.85 66.32,50.07 v66.2,49.85
  Top 0.25: 66.72,49.85 66.32,49.63 v66.2,49.85 | 66.72,43.5 66.32,43.72 v66.2,43.5 | 66.72,43.5 66.32,43.28 v66.2,43.5 | 62.12,43.5 61.72,43.72 v61.59,43.5 | 62.12,43.5 61.72,43.28 v61.59,43.5 | 57.31,35.13 57.09,34.73 v57.31,34.61 | 57.31,35.13 57.53,34.73 v57.31,34.61 | 52.7,32.02 52.93,32.42 v52.7,32.54 | 52.7,32.02 52.48,32.42 v52.7,32.54 | 60.33,32.18 60.55,32.58 v60.33,32.7 | 60.33,32.18 60.1,32.58 v60.33,32.7 | 62.87,31.86 63.09,32.26 v62.87,32.38 | 62.87,31.86 62.64,32.26 v62.87,32.38
  Top 0.5: C1.2 72.02,43.66 | 72.02,43.66 v72.55,43.66 | C2.2 72.02,42.07 | 72.02,42.07 v72.55,42.07 | C36.2 78.9,79.01 | 78.9,79.01 v78.9,79.53 | C35.2 77.31,79.01 | 77.31,79.01 v77.31,79.53 | D1.A 81.12,79.96 | 81.12,79.96 v81.12,80.49 | R24.1 46.99,70.12 | 46.99,70.12 v46.99,70.64 | R23.1 48.58,70.12 | 48.58,70.12 v48.58,70.64 | C12.- 40.01,68.21 | 40.01,68.21 v40.01,68.74 | C7.2 23.87,81.12 24.72,81.12 | 24.72,81.12 v25.24,81.12 | C5.2 23.87,79.22 24.72,79.22 | 24.72,79.22 v25.24,79.22 | 72.02,43.66 72.52,43.53 v72.55,43.66 | 72.02,43.66 72.52,43.78 v72.55,43.66 | 72.02,42.07 72.52,41.94 v72.55,42.07 | 72.02,42.07 72.52,42.19 v72.55,42.07 | 78.9,79.01 79.02,79.5 v78.9,79.53 | 78.9,79.01 78.77,79.5 v78.9,79.53 | 77.31,79.01 77.44,79.5 v77.31,79.53 | 77.31,79.01 77.19,79.5 v77.31,79.53 | 81.12,79.96 81.25,80.45 v81.12,80.49 | 81.12,79.96 81,80.45 v81.12,80.49 | 46.99,70.12 47.11,70.61 v46.99,70.64 | 46.99,70.12 46.87,70.61 v46.99,70.64 | 48.58,70.12 48.7,70.61 v48.58,70.64 | 48.58,70.12 48.45,70.61 v48.58,70.64 | 40.01,68.21 40.13,68.71 v40.01,68.74 | 40.01,68.21 39.88,68.71 v40.01,68.74 | 24.72,81.12 25.21,81 v25.24,81.12 | 24.72,81.12 25.21,81.25 v25.24,81.12 | 24.72,79.22 25.21,79.09 v25.24,79.22 | 24.72,79.22 25.21,79.34 v25.24,79.22
  other vias: 74.61,65.41 75.56,65.41 76.52,65.41 77.47,65.41 78.42,65.41 74.61,64.45 74.61,63.5 74.61,62.55 74.61,61.59 75.56,64.45 75.56,63.5 75.56,62.55 75.56,61.59 76.52,64.45 76.52,63.5 76.52,62.55 76.52,61.59 77.47,64.45 77.47,63.5 77.47,62.55 77.47,61.59 78.42,64.45 78.42,63.5 78.42,62.55 78.42,61.59 80.01,73.34 81.76,73.98 79.22,72.71 75.41,72.71 76.68,68.58 74.93,68.26 73.5,68.26 71.91,68.26 70.33,68.26 68.26,68.26 61.91,69.85 63.82,66.04 63.82,64.93 59.21,62.55 56.36,62.55 56.36,60.01 59.21,60.01 55.72,65.88 55.72,64.29 55.4,58.26 55.72,55.24 53.82,55.24 51.75,55.24 50.8,54.45 48.58,56.2 73.34,74.93 71.28,74.93 69.69,74.93 67.94,74.93 66.04,74.93 63.98,74.93 56.52,75.88 58.1,75.88 59.69,75.88 61.59,75.88 58.9,80.8 60.64,80.8 63.5,79.69 64.93,78.11 66.2,76.99 48.74,64.61 53.5,66.04 38.42,62.23 36.2,62.23 34.61,62.23 32.38,62.23 29.05,62.23 30.64,62.23 38.42,50.8 40.01,50.8 39.05,52.39
  pour Top (no thermals): 20.32,70.48 20.32,50.8 32.38,50.8 32.38,35.56 49.53,35.56 49.53,0 91.5,0 arc90 93.5,2 93.5,85.5 arc90 91.5,87.5 2.5,87.5 arc90 0,85 0,70.48
  cutout Top: 32.78,87.5 32.78,85 57.47,85 57.47,87.5
  pour Bottom (no thermals): 20.32,70.48 20.32,50.8 32.38,50.8 32.38,35.56 49.53,35.56 49.53,0 91.5,0 arc90 93.5,2 93.5,85.5 arc90 91.5,87.5 2.5,87.5 arc90 0,85 0,70.48
  cutout Bottom: 93.34,72.39 85.09,72.39 85.09,52.7 93.34,52.7
  cutout Top: 93.34,72.39 85.09,72.39 85.09,52.7 93.34,52.7
GPIO22
  Top 0.25: JP3.5 87.15,48.26 85.88,49.53 82.71,49.53 81.46,50.78 U4.36
GPIO23
  Top 0.25: U4.37 82.73,51.57 83.5,50.8 JP3.6
K1
  Top 0.25: M4.3 46.67,61.59 45.82,60.74 R25.1 45.82,58.2 45.4,57.78 39.37,57.78 38.81,57.23 38.81,53.42 37.62,52.23 M1.1
  Top 0.5: M1.1 39.06,49.74 R4.2
K2
  Top 0.25: M3.3 51.91,61.59 51.06,60.74 R27.1 51.06,57.57 50.48,56.99 46.67,56.99 46.04,56.36 46.04,52.23 45.09,51.28 M2.1
  Top 0.5: M2.1 46.52,49.74 R7.2
LINE
  Bottom 2: U$1.P$1 14.96,17.43 12.7,19.68 F1.1
LOAD1
  Bottom 2: K1.NO 35.75,21.14 33.96,19.36 U$1.P$3
LOAD2
  Bottom 2: K2.NO 43.37,14.06 U$1.P$4
N$1
  Top 0.5: K1.2 35.75,42.73 36.35,43.34 D3.A 36.35,46.2 36.67,46.51 M1.3 36.67,52.39 37.47,53.18 LED_K1.K
N$2
  Top 0.5: D21.2 62.92,24.44 F2.1 60.17,24.41 D19.1 59.89,25.84 58.71,27.01 R35.1 58.71,29.45 R13.2 R36.2
N$3
  Top 0.5: K2.2 43.37,43.05 43.81,43.5 D4.A 43.81,46.35 44.13,46.67 M2.3 44.13,51.59 44.77,52.23 LED_K2.K
N$4
  Top 0.5: R8.2 48.26,51.59 47.31,52.55 LED_K2.A
N$5
  Top 0.25: R29.1 59.69,40.96 60.01,41.27 OP1.1
N$6
  Top 0.5: R3.2 40.8,51.91 40.01,52.7 LED_K1.A
N$7
  Top 0.5: D20.1 52.86,26.63 F3.1 55.56,24.41 D19.2 55.84,25.68 57.01,26.85 R35.2 57.01,29.45 R14.2 R37.1
N$8
  Top 0.25: OP2.1 64.61,42.23 66.04,40.8 R32.1
N$9
  Top 0.25: C16.2 R26.2 | R26.2 R22.2 | M3.1 52.86,65.72 52.07,66.52 R26.2
N$10
  Bottom 2: F1.2 7.62,27.3 6.99,27.94 R1.2 6.99,34.13 5.56,35.56 C6.1 3.94,39.66 5.23,40.95 L1.4
N$11
  Top 0.25: IC7.6 56.36,36.83 56.04,36.51 56.04,33.5 56.99,32.54 R14.1
N$12
  Top 0.25: IC7.7 58.42,38.1 58.74,37.78 R13.1
N$13
  Top 0.5: R5.2 10.26,79.27 9.53,80.01 LE4.A
N$16
  Top 0.5: R12.1 C35.1 C36.1 78.9,75.56 79.22,75.25 D1.C 82.23,75.25 82.73,74.75 U4.2
N$17
  Top 0.5: BAT1.2 82.47,33.58 83.5,34.61 D6.A
N$18
  Bottom 2: L1.3 7.43,51.15 3.57,55.01 PS1.2
  pour Bottom (no thermals): 2.6,59.85 4.52,59.85 4.52,58.02 2.6,58.02
  pour Top (no thermals): 2.6,59.85 4.52,59.85 4.52,58.02 2.6,58.02
N$19
  Bottom 2: PS1.1 11.47,63.94 15.43,59.98 L1.2
  pour Bottom (no thermals): 2.62,64.85 4.45,64.85 4.45,63.02 2.62,63.02
  pour Top (no thermals): 2.62,64.85 4.45,64.85 4.45,63.02 2.62,63.02
N$21  (via drill 3 pad 5)
  other vias: 4,83.95
N$22  (via drill 3 pad 5)
  other vias: 89.5,83.9
N$23  (via drill 3 pad 5.5)
  other vias: 89.5,3.65
N$25
  Top 0.5: R43.1 85.83,22.33 86.68,23.18 D5.A
N$26
  Top 0.25: C14.2 R24.2 | R24.2 R23.2 | M4.1 47.62,65.88 46.99,66.52 R24.2
N$27  (via drill 3 pad 5)
  other vias: 4,3.65
N$36
  Top 0.5: R10.2 20.64,81.28 LE3.A
NEUTRAL
  Bottom 2: 24.46,28.07 R1.1 14.61,33.97 16.19,35.56 C6.2 18.92,39.81 17.79,40.95 L1.1 | 24.46,28.07 28.07,28.07 30.09,30.09 K1.COM K2.COM | U$1.P$2 24.46,28.07
RS485_A
  Top 0.5: F3.2 56.24,20.51 57.09,19.66 U$7.3 U$7.7
RS485_B
  Top 0.5: F2.2 59.88,20.51 59.09,19.73 U$7.2 U$7.6
RS485_DERE  (via drill 0.35)
  Top 0.25: IC7.2 52.27,37.47 | 52.27,37.47 IC7.3 | 52.27,37.47 53.29,37.47 | 53.29,37.47 v53.82,37.47 | v64.93,70.96 65.45,70.96 | 65.45,70.96 67.4,70.96 U4.14 | 53.29,37.47 53.69,37.24 v53.82,37.47 | 53.29,37.47 53.69,37.69 v53.82,37.47 | 65.45,70.96 65.05,71.18 v64.93,70.96 | 65.45,70.96 65.05,70.74 v64.93,70.96
  Bottom 0.25: 64.4,70.96 61.75,70.96 60.62,69.83 60.62,54.77 59.91,54.06 54.53,54.06 53.82,53.34 53.82,37.99 | 64.4,70.96 v64.93,70.96 | 53.82,37.99 v53.82,37.47 | 53.82,37.99 53.59,37.59 v53.82,37.47 | 53.82,37.99 54.04,37.59 v53.82,37.47 | 64.4,70.96 64.81,70.74 v64.93,70.96 | 64.4,70.96 64.81,71.18 v64.93,70.96
RS485_RXD  (via drill 0.35)
  Top 0.25: U4.13 68.76,72.47 | 68.76,72.47 68.76,72.53 v68.42,72.87 | v51.12,40.96 51.12,40.43 | 51.12,40.43 51.12,39.69 51.44,39.37 IC7.1 | 68.76,72.47 68.67,72.92 v68.42,72.87 | 68.76,72.47 68.33,72.63 v68.42,72.87 | 51.12,40.43 51.34,40.84 v51.12,40.96 | 51.12,40.43 50.9,40.84 v51.12,40.96
  Bottom 0.25: v68.42,72.87 67.9,72.87 | 67.9,72.87 61.28,72.87 60.01,71.6 60.01,54.93 59.53,54.46 51.92,54.46 51.12,53.66 51.12,41.48 | 51.12,41.48 v51.12,40.96 | 67.9,72.87 68.3,72.64 v68.42,72.87 | 67.9,72.87 68.3,73.09 v68.42,72.87 | 51.12,41.48 50.9,41.08 v51.12,40.96 | 51.12,41.48 51.34,41.08 v51.12,40.96
RS485_TXD  (via drill 0.35)
  Top 0.25: U4.16 62.07,66.99 61.81,66.73 | 61.81,66.73 v61.44,66.36 | v54.77,37.78 54.77,37.26 | 54.77,37.26 54.77,36.2 54.13,35.56 IC7.4 | 61.81,66.73 61.37,66.6 v61.44,66.36 | 61.81,66.73 61.68,66.29 v61.44,66.36 | 54.77,37.26 54.99,37.66 v54.77,37.78 | 54.77,37.26 54.55,37.66 v54.77,37.78
  Bottom 0.25: v61.44,66.36 61.44,65.83 | 61.44,65.83 61.44,54.86 60.24,53.66 55.72,53.66 54.77,52.7 54.77,38.31 | 54.77,38.31 v54.77,37.78 | 61.44,65.83 61.66,66.23 v61.44,66.36 | 61.44,65.83 61.21,66.23 v61.44,66.36 | 54.77,38.31 54.55,37.91 v54.77,37.78 | 54.77,38.31 54.99,37.91 v54.77,37.78
SCL1  (via drill 0.35)
  Top 0.25: R9.1 IC1.16 77.42,38.89 | v73.82,52.55 73.82,53.07 | 73.82,53.07 73.82,54.03 U4.30 | 77.42,38.89 v77.95,38.89 | 73.82,53.07 73.6,52.67 v73.82,52.55 | 73.82,53.07 74.04,52.67 v73.82,52.55 | 77.42,38.89 77.82,38.67 v77.95,38.89 | 77.42,38.89 77.82,39.12 v77.95,38.89
  Bottom 0.25: 73.82,52.02 73.82,49.69 76.36,47.15 76.36,39.37 76.83,38.89 77.42,38.89 | 73.82,52.02 v73.82,52.55 | JP3.2 84.3,40.64 83.82,41.12 80.96,41.12 78.74,38.89 78.47,38.89 | 77.42,38.89 v77.95,38.89 | v77.95,38.89 78.47,38.89 | 73.82,52.02 74.04,52.42 v73.82,52.55 | 73.82,52.02 73.6,52.42 v73.82,52.55 | 77.42,38.89 77.82,38.67 v77.95,38.89 | 77.42,38.89 77.82,39.12 v77.95,38.89 | 78.47,38.89 78.07,39.12 v77.95,38.89 | 78.47,38.89 78.07,38.67 v77.95,38.89
SDA1  (via drill 0.35)
  Top 0.25: R2.1 72.39,40.48 72.71,40.16 IC1.15 76.63,40.16 | 76.63,40.16 v77.15,40.16 | v75.09,52.55 75.09,53.07 | 75.09,53.07 75.09,54.03 U4.31 | 76.63,40.16 77.03,39.94 v77.15,40.16 | 76.63,40.16 77.03,40.39 v77.15,40.16 | 75.09,53.07 74.87,52.67 v75.09,52.55 | 75.09,53.07 75.31,52.67 v75.09,52.55
  Bottom 0.25: v77.15,40.16 77.15,40.69 | 77.15,40.69 77.15,43.18 | 77.15,43.18 77.15,47.47 75.09,49.53 75.09,52.02 | 75.09,52.02 v75.09,52.55 | JP3.3 77.15,43.18 | 77.15,40.69 76.93,40.29 v77.15,40.16 | 77.15,40.69 77.37,40.29 v77.15,40.16 | 75.09,52.02 75.31,52.42 v75.09,52.55 | 75.09,52.02 74.87,52.42 v75.09,52.55
SW1
  Top 0.25: R29.2 R28.1 C19.2 63.72,37.94 68.42,37.94 69.53,36.83 72.55,36.83 73.18,36.2 73.18,13.18 73.66,12.7 75.88,12.7 76.24,13.06 U$2.6
SW2
  Top 0.25: C20.2 R32.2 R31.1 68.71,37.09 69.37,36.43 72.22,36.43 72.78,35.87 72.78,15.05 U$2.8
VBAT
  Top 0.5: D6.C D5.C 86.67,28.26 85.41,28.26 84.45,27.3 80.8,27.3 79.85,28.26 79.85,40.48 78.9,41.43 IC1.14

### Text on the board
Top: Designed by: Lý Trần Quốc Uy
tPlace: Board EVC_HMI485 V1.0 | SolarEV
bPlace: BOARD ĐIỀU KHIỂN TRẠM SẠC XE ĐIỆN
tNames: 5V | 3V | BOOT | RESET | LD1117 | GND | RESET | C12 | TX | ANTENNA | RX | BOOT | 3V | G23 | G22 | GND | DS3231 | SDA1 | ESP32-WROOM | SCL1 | SW1 | GPIO34 | VB | C6 | SW2 | GPIO35 | TX485 | GPIO13 | RX485 | GPIO14 | R1 | K1 | GPIO15 | K2 | GPIO21 | F1 | SDA1 | GPIO19 | SCL1 | GPIO18 | RS485 | HMI/SW | L | N | OUT1 | OUT2
bNames: GND | RESET | TX | RX | BOOT | 3V | G23 | G22 | GND | SDA1 | SCL1 | VB | GND | A | B | GND | GND | RX2 | TX2 | 5V | GND | A | B | GND | SW2 | 5V | SW1 | 5V